# Altium schematic sheet wikitoy.SchDoc
size A4
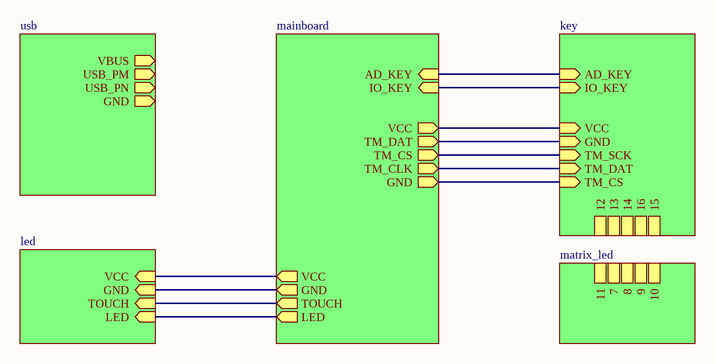
[diagram p0: wikitoy.SchDoc]

## Sub-sheets
Designator = mainboard: AD_KEY (in), IO_KEY (in), VCC (out), GND (out), TM_DAT (out), TM_CS (out), TM_CLK (out), VCC (out), GND (out), TOUCH (out), LED (out)
Designator = key: VCC (in), GND (in), TM_SCK (in), TM_DAT (in), TM_CS (in), 12, 13, 14, 15, 16, AD_KEY (in), IO_KEY (in)
Designator = led: VCC (in), GND (in), TOUCH (in), LED (in)
Designator = usb: VBUS (out), USB_PM (out), USB_PN (out), GND (out)
Designator = matrix_led: 7, 8, 9, 10, 11

## Nets
(unnamed): sheet Designator/AD_KEY, sheet Designator/AD_KEY
(unnamed): sheet Designator/IO_KEY, sheet Designator/IO_KEY
(unnamed): sheet Designator/VCC, sheet Designator/VCC
(unnamed): sheet Designator/GND, sheet Designator/TM_CS
(unnamed): sheet Designator/TM_DAT, sheet Designator/GND
(unnamed): sheet Designator/TM_CS, sheet Designator/TM_SCK
(unnamed): sheet Designator/TM_CLK, sheet Designator/TM_DAT
(unnamed): sheet Designator/VCC, sheet Designator/VCC
(unnamed): sheet Designator/GND, sheet Designator/GND
(unnamed): sheet Designator/TOUCH, sheet Designator/TOUCH
(unnamed): sheet Designator/LED, sheet Designator/LED